# Altium schematic sheet Sheet1.SchDoc
size A3; SheetNumber: 1; SheetTotal: 1
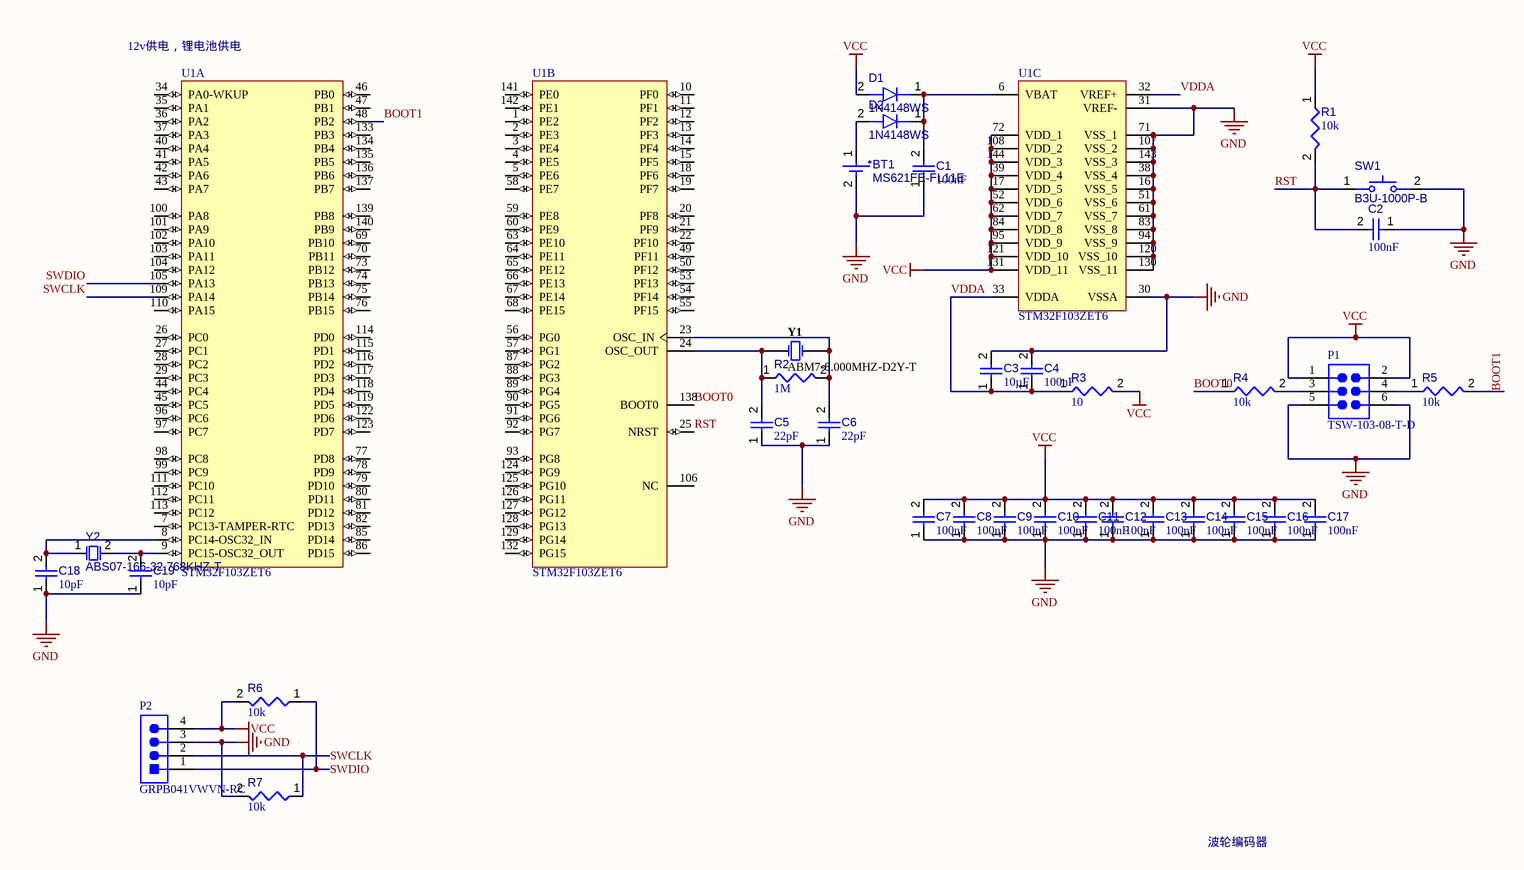
[diagram p0: Sheet1.SchDoc]

## Parts
BT1  MS621FE-FL11E  [SEIK-MS621FE-FL11E-2_V]
C1  value 100nF  [CAPC1608X90X40NL10T20]  (hidden comment: Capacitor 100 nF +/-10% 50 V 0603)
C2  value 100nF  [CAPC1608X90X40NL10T20]  (hidden comment: Capacitor 100 nF +/-10% 50 V 0603)
C3  value 10µF  [CAPC0603(1608)100_L]  (hidden comment: Capacitor 10µF +/-20% 10V 0603)
C4  value 100nF  [CAPC1608X90X40NL10T20]  (hidden comment: Capacitor 100 nF +/-10% 50 V 0603)
C5  value 22pF  [CAPC1608X90X35ML10T15]  (hidden comment: GRM1885C1H220JA01D)
C6  value 22pF  [CAPC1608X90X35ML10T15]  (hidden comment: GRM1885C1H220JA01D)
C7  value 100nF  [CAPC1608X90X40NL10T20]  (hidden comment: Capacitor 100 nF +/-10% 50 V 0603)
C8  value 100nF  [CAPC1608X90X40NL10T20]  (hidden comment: Capacitor 100 nF +/-10% 50 V 0603)
C9  value 100nF  [CAPC1608X90X40NL10T20]  (hidden comment: Capacitor 100 nF +/-10% 50 V 0603)
C10  value 100nF  [CAPC1608X90X40NL10T20]  (hidden comment: Capacitor 100 nF +/-10% 50 V 0603)
C11  value 100nF  [CAPC1608X90X40NL10T20]  (hidden comment: Capacitor 100 nF +/-10% 50 V 0603)
C12  value 100nF  [CAPC1608X90X40NL10T20]  (hidden comment: Capacitor 100 nF +/-10% 50 V 0603)
C13  value 100nF  [CAPC1608X90X40NL10T20]  (hidden comment: Capacitor 100 nF +/-10% 50 V 0603)
C14  value 100nF  [CAPC1608X90X40NL10T20]  (hidden comment: Capacitor 100 nF +/-10% 50 V 0603)
C15  value 100nF  [CAPC1608X90X40NL10T20]  (hidden comment: Capacitor 100 nF +/-10% 50 V 0603)
C16  value 100nF  [CAPC1608X90X40NL10T20]  (hidden comment: Capacitor 100 nF +/-10% 50 V 0603)
C17  value 100nF  [CAPC1608X90X40NL10T20]  (hidden comment: Capacitor 100 nF +/-10% 50 V 0603)
C18  value 10pF  [CAPC1005X55X25ML05T05]  (hidden comment: Capacitor 10 pF +/- 5% 50 V 0402)
C19  value 10pF  [CAPC1005X55X25ML05T05]  (hidden comment: Capacitor 10 pF +/- 5% 50 V 0402)
D1  1N4148WS  [FP-477AB-IPC_A]
D2  1N4148WS  [FP-477AB-IPC_A]
P1  TSW-103-08-T-D  [SMTC-TSW-103-08-X-D]
P2  GRPB041VWVN-RC  [SLIN-GRPB041VWVN-RC_V]
R1  value 10k  [RESC1608X55X25ML10T15]  (hidden comment: Resistor 10k +/-1% 0603 100 mW)
R2  value 1M  [FP-ERJ3EK-IPC_A]  (hidden comment: ERJ-3EKF1004V)
R3  value 10  [RESC0603(1608)_L]  (hidden comment: ERJ3EKF10R0V)
R4  value 10k  [RESC1608X55X25ML10T15]  (hidden comment: Resistor 10k +/-1% 0603 100 mW)
R5  value 10k  [RESC1608X55X25ML10T15]  (hidden comment: Resistor 10k +/-1% 0603 100 mW)
R6  value 10k  [RESC1608X55X25ML10T15]  (hidden comment: Resistor 10k +/-1% 0603 100 mW)
R7  value 10k  [RESC1608X55X25ML10T15]  (hidden comment: Resistor 10k +/-1% 0603 100 mW)
SW1  B3U-1000P-B  [OMRON-B3U-1000P-2-B_V]
U1  STM32F103ZET6  [STM-LQFP144_N]  (parts A,B,C of 3)
Y1  ABM7-8.000MHZ-D2Y-T  [FP-ABM7-MFG]
Y2  ABS07-166-32.768KHZ-T  [EPSON-FC-135_V]

## Nets
GND: BT1.2(-) C1.1 C2.1 C3.2 C4.2 C5.1 C6.1 C7.1 C8.1 C9.1 C10.1 C11.1 C12.1 C13.1 C14.1 C15.1 C16.1 C17.1 C18.1 C19.1 P1.5 P1.6 P2.3 R7.2 SW1.2 U1.16(VSS_5) U1.30(VSSA) U1.31(VREF-) U1.38(VSS_4) U1.51(VSS_6) U1.61(VSS_7) U1.71(VSS_1) U1.83(VSS_8) U1.94(VSS_9) U1.107(VSS_2) U1.120(VSS_10) U1.130(VSS_11) U1.143(VSS_3)
VCC: C7.2 C8.2 C9.2 C10.2 C11.2 C12.2 C13.2 C14.2 C15.2 C16.2 C17.2 D1.2(A) P1.1 P1.2 P2.4 R1.1 R3.2 R6.2 U1.17(VDD_5) U1.39(VDD_4) U1.52(VDD_6) U1.62(VDD_7) U1.72(VDD_1) U1.84(VDD_8) U1.95(VDD_9) U1.108(VDD_2) U1.121(VDD_10) U1.131(VDD_11) U1.144(VDD_3)
BOOT0: R4.1 U1.138(BOOT0)
BOOT1: R5.2 U1.48(PB2)
RST: C2.2 R1.2 SW1.1 U1.25(NRST)
SWCLK: P2.2 R7.1 U1.109(PA14)
SWDIO: P2.1 R6.1 U1.105(PA13)
VDDA: C3.1 C4.1 R3.1 U1.32(VREF+) U1.33(VDDA)
NetBT1_1: BT1.1(+) D2.2(A)
NetC1_2: C1.2 D1.1(K) D2.1(K) U1.6(VBAT)
NetC5_2: C5.2 R2.1 U1.24(OSC_OUT) Y1.1
NetC6_2: C6.2 R2.2 U1.23(OSC_IN) Y1.2
NetC18_2: C18.2 U1.8(PC14-OSC32_IN) Y2.1
NetC19_2: C19.2 U1.9(PC15-OSC32_OUT) Y2.2
NetP1_3: P1.3 R4.2
NetP1_4: P1.4 R5.1

Not connected (* = marked no-connect by the designer): U1 1(PE2) 2(PE3) 3(PE4) 4(PE5) 5(PE6) 7(PC13-TAMPER-RTC) 10(PF0) 11(PF1) 12(PF2) 13(PF3) 14(PF4) 15(PF5) 18(PF6) 19(PF7) 20(PF8) 21(PF9) 22(PF10) 26(PC0) 27(PC1) 28(PC2) 29(PC3) 34(PA0-WKUP) 35(PA1) 36(PA2) 37(PA3) 40(PA4) 41(PA5) 42(PA6) 43(PA7) 44(PC4) 45(PC5) 46(PB0) 47(PB1) 49(PF11) 50(PF12) 53(PF13) 54(PF14) 55(PF15) 56(PG0) 57(PG1) 58(PE7) 59(PE8) 60(PE9) 63(PE10) 64(PE11) 65(PE12) 66(PE13) 67(PE14) 68(PE15) 69(PB10) 70(PB11) 73(PB12) 74(PB13) 75(PB14) 76(PB15) 77(PD8) 78(PD9) 79(PD10) 80(PD11) 81(PD12) 82(PD13) 85(PD14) 86(PD15) 87(PG2) 88(PG3) 89(PG4) 90(PG5) 91(PG6) 92(PG7) 93(PG8) 96(PC6) 97(PC7) 98(PC8) 99(PC9) 100(PA8) 101(PA9) 102(PA10) 103(PA11) 104(PA12) 106(NC) 110(PA15) 111(PC10) 112(PC11) 113(PC12) 114(PD0) 115(PD1) 116(PD2) 117(PD3) 118(PD4) 119(PD5) 122(PD6) 123(PD7) 124(PG9) 125(PG10) 126(PG11) 127(PG12) 128(PG13) 129(PG14) 132(PG15) 133(PB3) 134(PB4) 135(PB5) 136(PB6) 137(PB7) 139(PB8) 140(PB9) 141(PE0) 142(PE1)

## Notes on the sheet
- (near U1) 12v供电，锂电池供电
- 波轮编码器

## Library data of the parts
BT1 = CMP-00029-00000-1: MS Lihium Rechargeable Battery, 3 V, -20 to 60 degC, Tray; RoHS Compliant: NotApplicable; Mounting Technology: WithLeads; Pins: 2
C1 C2 C4 C7-C17 = CMP-001-00017-6: Chip Capacitor, 100 nF, +/- 10%, 50 V, 0603 (1608 Metric); Voltage Rating: 50V; Capacitor Type: Ceramic; Tolerance: 10%; Mounting Technology: SM; Max Operating Temperature: 125°C; RoHS Compliant: True; Pins: 2; Case/Package: 0603; Min Operating Temperature: -55°C
C3 = CMP-001-00075-4: Chip Capacitor, 10µF +/-20%, 10V, 0603, Thickness 1 mm; Tolerance: 10%; Voltage Rating: 10V; Max Operating Temperature: 85°C; Pins: 2; Case/Package: 0603; Mounting Technology: SMT; Min Operating Temperature: -55°C
C5 C6 = CMP-001-00089-1: CAP CER 22PF 50V C0G/NP0 0603; Tolerance: 10%; Max Operating Temperature: 125°C; Min Operating Temperature: -55°C; Voltage Rating: 50V; Case/Package: 0603; RoHS Compliant: Yes; Mounting Technology: Surface Mount; Pins: 2
C18 C19 = CMP-001-00013-6: Chip Capacitor, 10 pF, +/- 5%, 50 V, 0402 (1005 Metric); Capacitor Type: Ceramic; Voltage Rating: 50V; Max Operating Temperature: 125°C; Pins: 2; Mounting Technology: SM; Tolerance: 5%; RoHS Compliant: True; Case/Package: 0402; Min Operating Temperature: -55°C
D1 D2 = CMP-004-00033-1: Diode Ultra Fast Recovery Rectifier 75V 0.15A 2-Pin SOD-323F T/R; Forward Voltage: 1V; Forward Current: 150mA; Mounting Technology: Surface Mount; Min Operating Temperature: -55°C; Pins: 2; RoHS Compliant: Yes; Max Operating Temperature: 150°C
P1 = CMP-00008-1: Headers & Wire Housings Classic PCB Header Strips, 0.100 pitch
P2 = CMP-00010-1: Male, 4 C, Straight, .050" CC; 3.00mm Head/2.30mm Tail, No Mt; Nylon 9T, Brass, 105 C
R1 R4-R7 = CMP-009-00017-5: Chip Resistor, 10 KOhm, +/- 1%, 01 W, -55 to 155 degC, 0603 (1608 Metric); Voltage Rating: 50V; Power: 100mW; RoHS Compliant: True; Min Operating Temperature: -55°C; Pins: 2; Case/Package: 0603; Mounting Technology: SM; Max Operating Temperature: 155°C; Tolerance: 1%
R2 = CMP-009-00178-1: Res Thick Film 0603 1M Ohm 1% 1/10W ±100ppm/°C Molded SMD Punched Carrier T/R; Voltage Rating: 75V; Max Operating Temperature: 155°C; Pins: 2; Case/Package: 0603; Tolerance: 1%; Mounting Technology: Surface Mount; Min Operating Temperature: -55°C; RoHS Compliant: Yes
R3 = CMP-009-00179-1: Res Thick Film 0603 10 Ohm 1% 0.1W(1/10W) +/-100ppm/C Molded SMD Automotive Punched T/R; Voltage Rating: 75V; Max Operating Temperature: 155°C; Mounting Technology: Surface Mount; Min Operating Temperature: -55°C; Pins: 2; Case/Package: 0603; RoHS Compliant: Yes; Tolerance: 1%
SW1 = CMP-011-00011-4: Ultra-small Surface-mounting Tactile Switches with High Contact Reliability, SPST-NO, -25 to 70 degC, 2-Pin SMD, RoHS, Tape and Reel; Voltage Rating: 12V; Current Rating: 50mA; Pins: 2; RoHS Compliant: Details
U1 = CMP-020-00025-1: MCU 32-bit STM32F1 ARM Cortex M3 RISC 512KB Flash 2.5V/3.3V 144-Pin LQFP Tray; Min Supply Voltage: 2V; Max Supply Voltage: 3.6V; Frequency: 72MHz; RAM Size: 64KB; Interface: I2C,SPI,USB,CAN,IrDA,UART,USART,LIN,I2S,SDIO; Case/Package: LQFP; Min Operating Temperature: -40°C; Clock Frequency: 72MHz; Max Operating Temperature: 85°C; RoHS Compliant: Yes; Pins: 144
Y1 = CMP-003-00030-1: Crystal 8MHz ±20ppm (Tol) ±30ppm (Stability) 18pF FUND 100Ohm 2-Pin Mini-CSMD T/R; ESR: 80; Max Operating Temperature: 85°C; Pins: 2; Case/Package: CSMD; Mounting Technology: Surface Mount; Min Operating Temperature: -40°C; Load Capacitance: 18pF; Frequency: 8MHz
Y2 = CMP-003-00029-1: Crystal 32.768kHz 10ppm 7pF -40C +85C; Pins: 2; Frequency: 32.768kHz